# EAGLE design diversity (EAGLE 7.2.0)
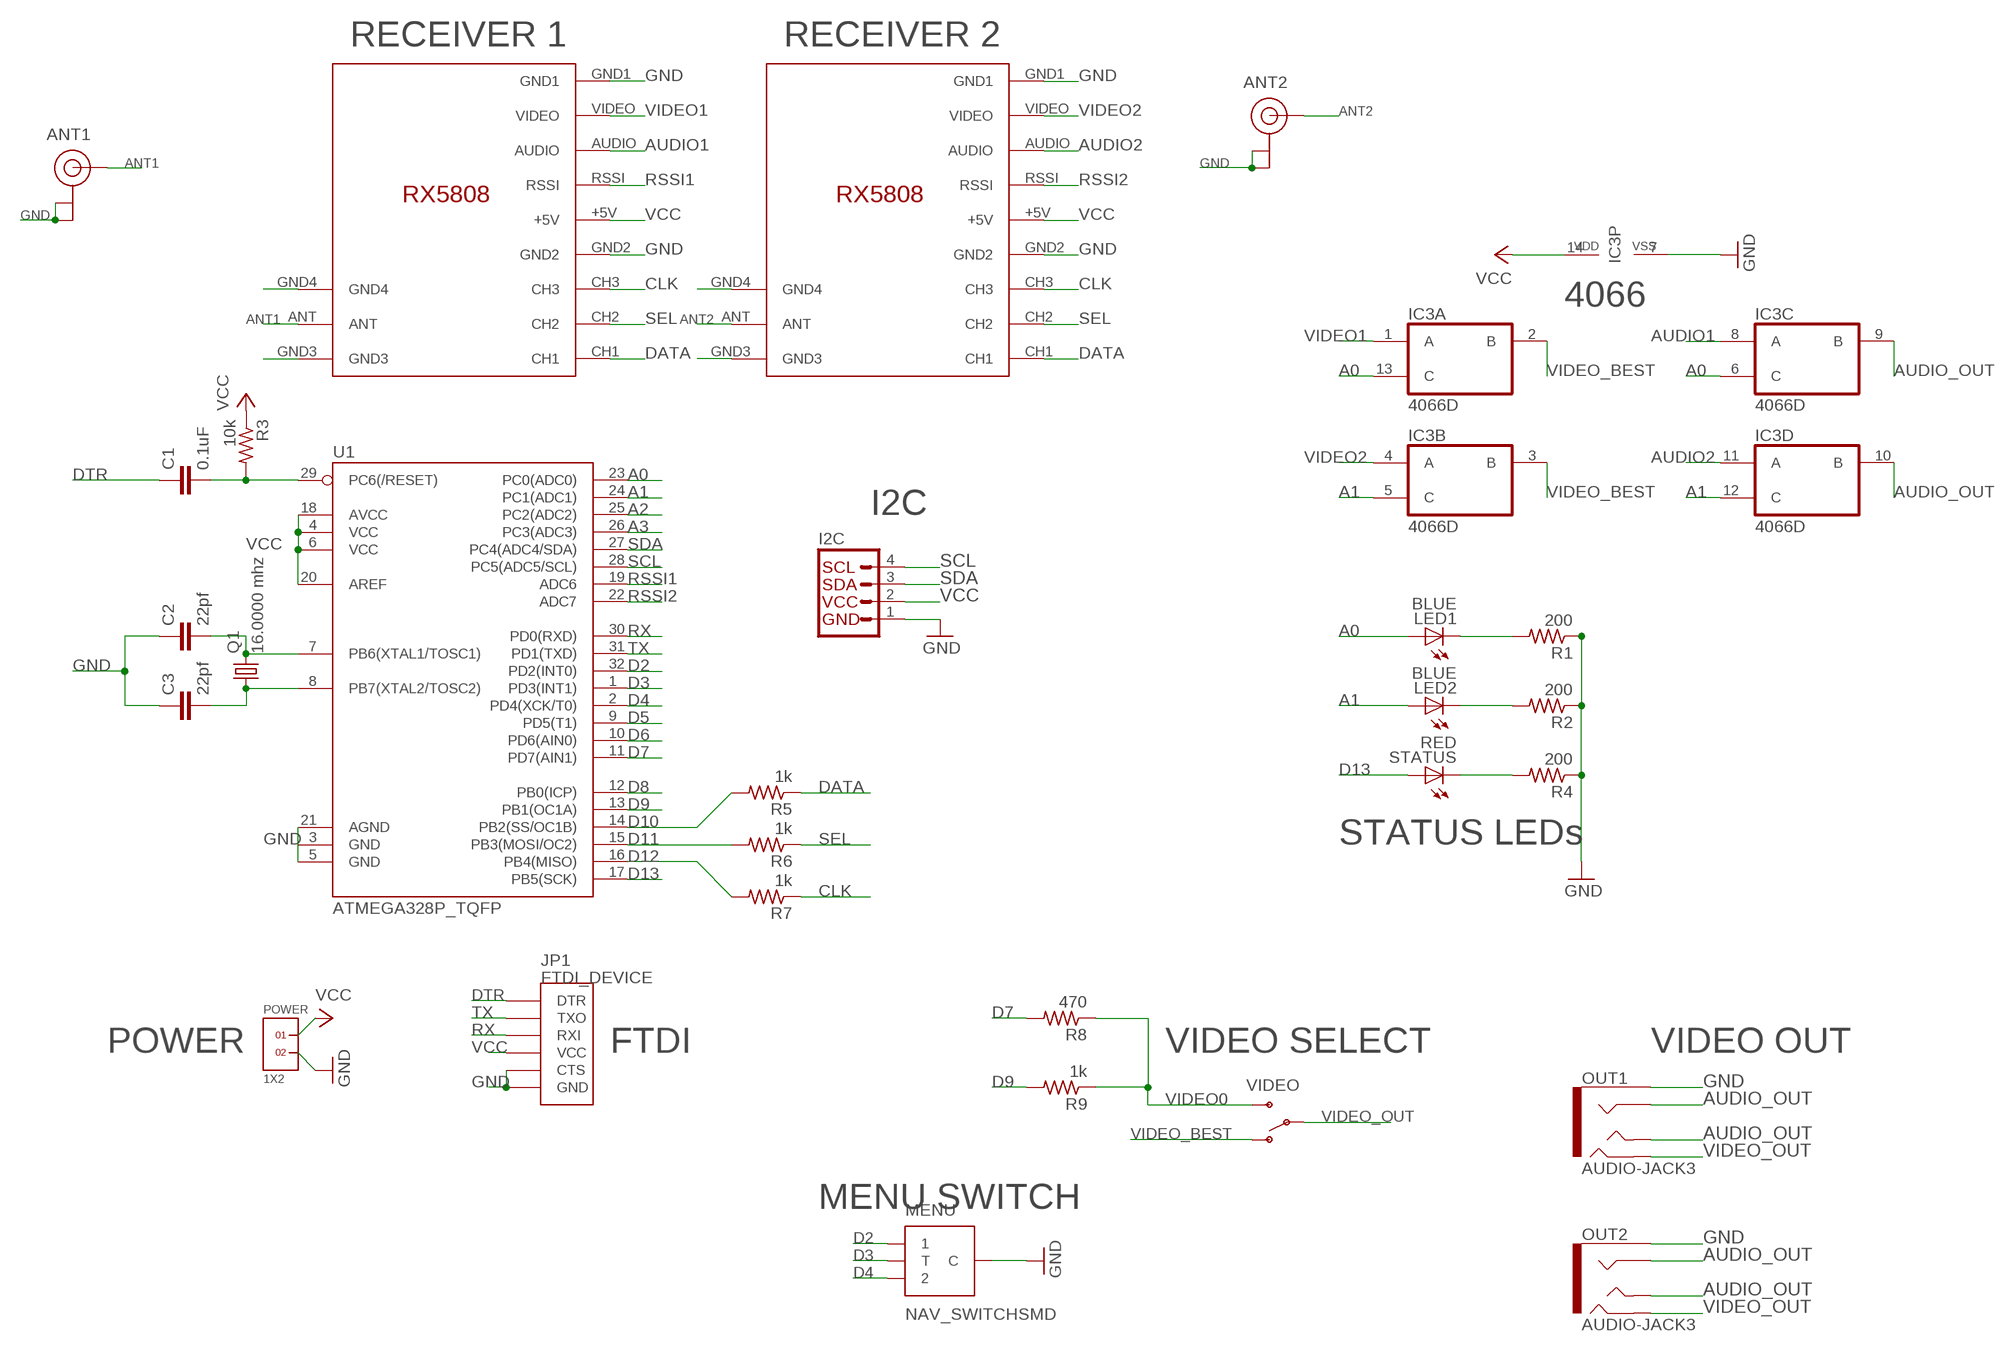
[diagram p0: schematic, sheet 1]

## Parts
ANT1  U.FL  [U.FL]
ANT2  U.FL  [U.FL]
C1  0.1uF  0.1UF-25V(+80/-20%)(0603)  [0603-CAP]
C2  22pf  0.1UF-25V(+80/-20%)(0603)  [0603-CAP]
C3  22pf  0.1UF-25V(+80/-20%)(0603)  [0603-CAP]
I2C  I2C_STANDARD  [1X04]
IC3  4066D  [SO14]
JP1  FTDI_DEVICE  [FTDI_DEVICE_SIDE]
LED1  BLUE  LEDSML0603  [SML0603]
LED2  BLUE  LEDSML0603  [SML0603]
MENU  NAV_SWITCHSMD  [NAV_SWITCH]
OUT1  AUDIO-JACK3  [AUDIO-JACK-TRRS-SMD]
OUT2  AUDIO-JACK3  [AUDIO-JACK-TRRS-SMD]
POWER  1X2  [1X2]
Q1  16.0000 mhz  CRYSTALHC49U-V  [HC49U-V]
R1  200  R-US_R0603  [R0603]
R2  200  R-US_R0603  [R0603]
R3  10k  R-US_R0603  [R0603]
R4  200  R-US_R0603  [R0603]
R5  1k  R-US_R0603  [R0603]
R6  1k  R-US_R0603  [R0603]
R7  1k  R-US_R0603  [R0603]
R8  470  R-US_R0603  [R0603]
R9  1k  R-US_R0603  [R0603]
RECEIVER_A  RX5808_A  RX5808  [RX5808]
RECEIVER_B  RX5808_B  RX5808  [RX5808]
STATUS  RED  LEDSML0603  [SML0603]
U1  ATMEGA328P_TQFP  [TQFP32-08]
VIDEO  SWITCH-SPDTSMD2  [SWITCH-SPDT-SMD]

## Nets
A0: IC3.6(C:C) IC3.13(A:C) LED1.A U1.23(PC0(ADC0))
A1: IC3.5(B:C) IC3.12(D:C) LED2.A U1.24(PC1(ADC1))
A2: U1.25(PC2(ADC2))
A3: U1.26(PC3(ADC3))
ANT1: ANT1.P$3(SIGNAL) RECEIVER_A.ANT
ANT2: ANT2.P$3(SIGNAL) RECEIVER_B.ANT
AUDIO1: IC3.8(C:A) RECEIVER_A.AUDIO
AUDIO2: IC3.11(D:A) RECEIVER_B.AUDIO
AUDIO_OUT: IC3.9(C:B) IC3.10(D:B) OUT1.RING1 OUT1.TIP OUT2.RING1 OUT2.TIP
CLK: R7.1 RECEIVER_A.CH3 RECEIVER_B.CH3
D2: MENU.1 U1.32(PD2(INT0))
D3: MENU.T U1.1(PD3(INT1))
D4: MENU.2 U1.2(PD4(XCK/T0))
D5: U1.9(PD5(T1))
D6: U1.10(PD6(AIN0))
D7: R8.2 U1.11(PD7(AIN1))
D8: U1.12(PB0(ICP))
D9: R9.2 U1.13(PB1(OC1A))
D10: R5.2 U1.14(PB2(SS/OC1B))
D11: R6.2 U1.15(PB3(MOSI/OC2))
D12: R7.2 U1.16(PB4(MISO))
D13: STATUS.A U1.17(PB5(SCK))
DATA: R5.1 RECEIVER_A.CH1 RECEIVER_B.CH1
DTR: C1.1 JP1.P$1(DTR)
GND: ANT1.P$1(GND) ANT1.P$2(GND) ANT2.P$1(GND) ANT2.P$2(GND) C2.1 C3.1 I2C.1 IC3.7(P:VSS) JP1.P$5(CTS) JP1.P$6(GND) MENU.C OUT1.EARTH OUT2.EARTH POWER.2 R1.1 R2.1 R4.1 RECEIVER_A.GND1 RECEIVER_A.GND2 RECEIVER_A.GND3 RECEIVER_A.GND4 RECEIVER_B.GND1 RECEIVER_B.GND2 RECEIVER_B.GND3 RECEIVER_B.GND4 U1.5(GND) U1.21(AGND)
N$1: LED1.C R1.2
N$2: LED2.C R2.2
N$5: C2.2 Q1.2 U1.7(PB6(XTAL1/TOSC1))
N$6: C1.2 R3.2 U1.29(PC6(/RESET))
N$7: C3.2 Q1.1 U1.8(PB7(XTAL2/TOSC2))
N$28: R4.2 STATUS.C
RSSI1: RECEIVER_A.RSSI U1.19(ADC6)
RSSI2: RECEIVER_B.RSSI U1.22(ADC7)
RX: JP1.P$3(RXI) U1.30(PD0(RXD))
SCL: I2C.4 U1.28(PC5(ADC5/SCL))
SDA: I2C.3 U1.27(PC4(ADC4/SDA))
SEL: R6.1 RECEIVER_A.CH2 RECEIVER_B.CH2
TX: JP1.P$2(TXO) U1.31(PD1(TXD))
VCC: I2C.2 IC3.14(P:VDD) JP1.P$4(VCC) POWER.1 R3.1 RECEIVER_A.+5V RECEIVER_B.+5V U1.4(VCC) U1.6(VCC) U1.18(AVCC) U1.20(AREF)
VIDEO0: R8.1 R9.1 VIDEO.3(S)
VIDEO1: IC3.1(A:A) RECEIVER_A.VIDEO
VIDEO2: IC3.4(B:A) RECEIVER_B.VIDEO
VIDEO_BEST: IC3.2(A:B) IC3.3(B:B) VIDEO.1(O)
VIDEO_OUT: OUT1.RING2 OUT2.RING2 VIDEO.2(P)
Unconnected: U1.3(GND)

## Notes on the sheet
- RECEIVER 1 | RECEIVER 2
- 4066
- I2C
- STATUS LEDs
- POWER | FTDI | VIDEO SELECT | VIDEO OUT
- MENU SWITCH

## Library data of the parts
ANT1 ANT2 = SparkFun-Connectors:U.FL: SMD antenna connector- WRL-09144; PROD_ID: CONN-09193
C1 = SparkFun-Capacitors:0.1UF-25V(+80/-20%)(0603): CAP-00810 Ceramic Standard decoupling cap; PROD_ID: CAP-00810
C2 C3 = SparkFun-Capacitors:0.1UF-25V(+80/-20%)(0603): CAP-00810 Ceramic Standard decoupling cap; PROD_ID: CAP-00810; VALUE: 0.1uF
I2C = SparkFun-Connectors:I2C_STANDARD: SparkFun has standardized on a pinout for all I2C based sensor breakouts. This pinout allows I2C boards to be plugged directly into the headers on Arduino Uno compatible boards, and to be daisy chained easily.
IC3 = 40xx:4066: Quad bilateral ANALOG SWITCH
JP1 = SparkFun-Connectors:FTDI_DEVICE: Connector which mates to FTDI basic or FTDI cable.
LED1 LED2 STATUS = led:LED: LED OSRAM: - CHIPLED LG R971, LG N971, LY N971, LG Q971, LY Q971, LO R971, LY R971 LH N974, LH R974 LS Q976, LO Q976, LY Q976 LO Q996 - Hyper CHIPLED LW Q18S LB Q993, LB Q99A, LB R99A - SideLED LS A670, LO A670, LY A670, LG A670, LP A670 LB A673, LV A673, LT A673, LW A673 LH A674 LY A675 LS A676, LA A676, LO A676, LY A676, LW A676 LS A679, LY A679, LG A679 - Hyper Micro SIDELED® LS Y876, LA Y876, LO Y876, LY Y876 LT Y87S - SmartLED LW L88C, LW L88S LB L89C, LB L89S, LG L890 LS L89K, LO L89K, LY L89K LS L896, LA L896, LO L896, LY L896 - TOPLED LS T670, LO T670, LY T670, LG T670, LP T670 LSG T670, LSP T670, LSY T670, LOP T670, LYG T670 LG T671, LOG T671, LSG T671 LB T673, LV T673, LT T673, LW T673 LH T674 LS T676, LA T676, LO T676, LY T676, LB T676, LH T676, LSB T676, LW T676 LB T67C, LV T67C, LT T67C, LS T67K, LO T67K, LY T67K, LW E67C LS E67B, LA E67B, LO E67B, LY E67B, LB E67C, LV E67C, LT E67C LW T67C LS T679, LY T679, LG T679 LS T770, LO T770, LY T770, LG T770, LP T770 LB T773, LV T773, LT T773, LW T773 LH T774 LS E675, LA E675, LY E675, LS T675 LS T776, LA T776, LO T776, LY T776, LB T776 LHGB T686 LT T68C, LB T68C - Hyper Mini TOPLED® LB M676 - Mini TOPLED Santana® LG M470 LS M47K, LO M47K, LY M47K Source: http://www.osram.convergy.de LUXEON: - LUMILED® LXK2-PW12-R00, LXK2-PW12-S00, LXK2-PW14-U00, LXK2-PW14-V00 LXK2-PM12-R00, LXK2-PM12-S00, LXK2-PM14-U00 LXK2-PE12-Q00, LXK2-PE12-R00, LXK2-PE12-S00, LXK2-PE14-T00, LXK2-PE14-U00 LXK2-PB12-K00, LXK2-PB12-L00, LXK2-PB12-M00, LXK2-PB14-N00, LXK2-PB14-P00, LXK2-PB14-Q00 LXK2-PR12-L00, LXK2-PR12-M00, LXK2-PR14-Q00, LXK2-PR14-R00 LXK2-PD12-Q00, LXK2-PD12-R00, LXK2-PD12-S00 LXK2-PH12-R00, LXK2-PH12-S00 LXK2-PL12-P00, LXK2-PL12-Q00, LXK2-PL12-R00 Source: www.luxeon.com KINGBRIGHT: KA-3528ASYC Source: www.kingbright.com
MENU = SparkFun-Electromechanical:NAV_SWITCH: Navigation Switch Three way navigation switch. Commonly used as up/down/select on MP3 players. Schematic element and footprint production proven. Spark Fun Electronics SKU : COM-08184; PROD_ID: SWCH-08301
OUT1 OUT2 = SparkFun-Connectors:AUDIO-JACK3: Audio jack - 3.5mm TRRS variety - two rings.
POWER = headers(.1in):1X2
Q1 = crystal:CRYSTAL: CRYSTAL; OC_FARNELL: 1666969; OC_NEWARK: unknown
R1-R9 = resistor:R-US_: RESISTOR, American symbol
RECEIVER_A RECEIVER_B = 1customstuff:RX5808
U1 = SparkFun-DigitalIC:ATMEGA328P_TQFP; PROD_ID: IC-09069
VIDEO = SparkFun-Electromechanical:SWITCH-SPDT: SPDT Switch Simple slide switch, Spark Fun Electronics SKU : COM-00102 DPDT SMT slide switch, AYZ0202, SWCH-08179

## Board
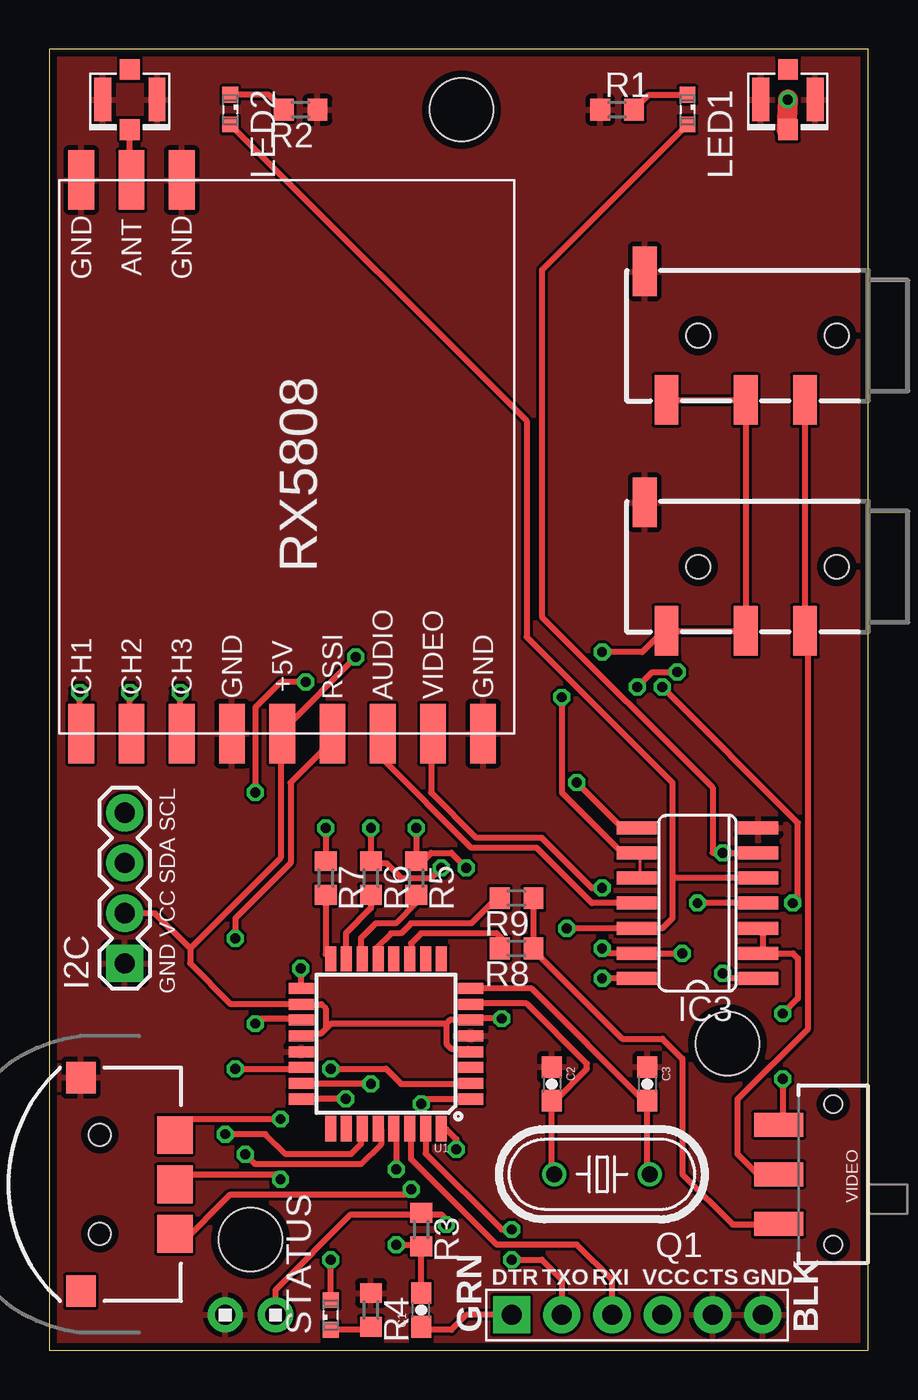
[diagram p1: board, top side]
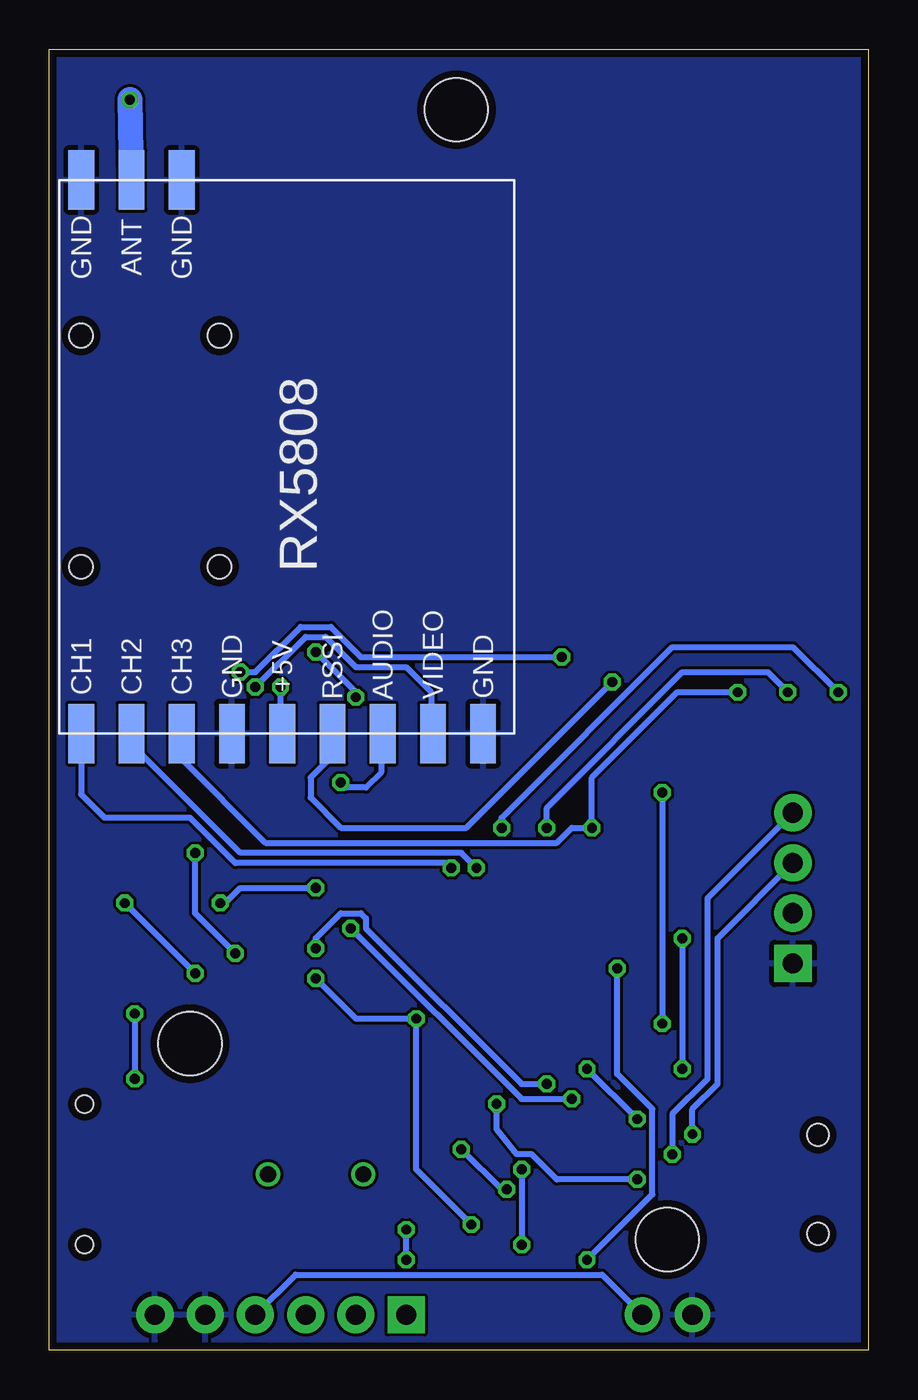
[diagram p2: board, bottom side, seen from below]

Size 41.4 x 65.79 mm. Coordinates in mm from the lower left corner, seen from the top.
Outline: 0,0 41.4,0 41.4,65.79 0,65.79 0,0
Copper layers (1*16): Top 0.0356mm / dielectric 1.5011mm / Bottom 0.0356mm
Design rules "LaenPCBOrder": minimum track width 6mil, minimum drill 13mil, track to track 6mil, track to pad 6mil, pad to pad 6mil, via to via 6mil, smd to smd 6mil, copper to edge 15mil, drill to drill 6mil, minimum pad ring 7mil, minimum via ring 7mil, stop-mask expansion 3mil, vias tented up to drill 0mil, thermal gap 10mil
Holes 3.2 mm at 20.83,62.74 34.29,15.49 10.16,5.59

### Footprints (pad centres in the part's own frame; a part is rotated, then mirrored left to right if it is on the bottom)
U.FL = smd 2.2 x 0.85: P$1 0,1.375; P$2 0,-1.375 | smd 1.05 x 1: P$3 1.525,0; P$4 -1.525,0
0603-CAP = smd 1.1 x 1: 1 -0.85,0; 2 0.85,0
1X04 = drill 1.016 pad 1.88 square: 1 0,0 | drill 1.016 pad 1.88: 2 2.54,0; 3 5.08,0; 4 7.62,0
SO14 = smd 0.66 x 2.032: 1 -3.81,-3.073; 2 -2.54,-3.073; 3 -1.27,-3.073; 4 0,-3.073; 5 1.27,-3.073; 6 2.54,-3.073; 7 3.81,-3.073; 8 3.81,3.073; 9 2.54,3.073; 10 1.27,3.073; 11 0,3.073; 12 -1.27,3.073; 13 -2.54,3.073; 14 -3.81,3.073
FTDI_DEVICE_SIDE = drill 1.016 pad 1.88 square: P$1 -6.35,0 | drill 1.016 pad 1.88: P$2 -3.81,0; P$3 -1.27,0; P$4 1.27,0; P$5 3.81,0; P$6 6.35,0
SML0603 = smd 0.8 x 0.8: A 0.75,0; C -0.75,0
NAV_SWITCH = smd 1.9 x 1.8: 1 -2.5,-3.8; 2 2.5,-3.8; T 0,-3.8 | smd 1.6 x 1.5: C 5.4,0.95; NC -5.4,0.95 | hole 1.1: -2.5,0; 2.5,0
AUDIO-JACK-TRRS-SMD = smd 1.2 x 2.5: EARTH 11.3,-3.25; RING1 6.2,3.25; RING2 3.2,3.25; TIP 10.2,3.25 | hole 1.2: 1.6,0; 8.6,0
1X2 = drill 1.016 pad 1.778: 1 0,0; 2 2.54,0
HC49U-V = drill 0.813: 1 -2.413,0; 2 2.413,0
R0603 = smd 1 x 1.1: 1 -0.85,0; 2 0.85,0
RX5808 = smd 3 x 1.3: +5V 28,11.26; ANT 0,3.64; AUDIO 28,16.34; CH1 28,1.1; CH2 28,3.64; CH3 28,6.18; GND1 28,21.42; GND2 28,8.72; GND3 0,1.1; GND4 0,6.18; RSSI 28,13.8; VIDEO 28,18.88
TQFP32-08 = smd 1.27 x 0.559: 1 -4.293,2.8; 2 -4.293,2; 3 -4.293,1.2; 4 -4.293,0.4; 5 -4.293,-0.4; 6 -4.293,-1.2; 7 -4.293,-2; 8 -4.293,-2.8; 17 4.293,-2.8; 18 4.293,-2; 19 4.293,-1.2; 20 4.293,-0.4; 21 4.293,0.4; 22 4.293,1.2; 23 4.293,2; 24 4.293,2.8 | smd 0.559 x 1.27: 9 -2.8,-4.293; 10 -2,-4.293; 11 -1.2,-4.293; 12 -0.4,-4.293; 13 0.4,-4.293; 14 1.2,-4.293; 15 2,-4.293; 16 2.8,-4.293; 25 2.8,4.293; 26 2,4.293; 27 1.2,4.293; 28 0.4,4.293; 29 -0.4,4.293; 30 -1.2,4.293; 31 -2,4.293; 32 -2.8,4.293
SWITCH-SPDT-SMD = smd 1.2 x 2.5: 1 -2.5,-2.75; 2 0,-2.75; 3 2.5,-2.75 | hole 0.9: -3.55,0; 3.55,0

### Placement (x,y rotation side)
ANT1  37.34,63.25 270 top
ANT2  4.06,63.25 270 top
C1  18.8,2.03 90 top
C2  25.4,13.46 270 top
C3  30.23,13.46 270 top
I2C  3.81,19.56 90 top
IC3  32.77,22.61 90 top
JP1  29.72,1.78 0 top
LED1  32.26,62.74 270 top
LED2  9.14,62.74 270 top
MENU  2.54,8.38 90 top
OUT1  41.4,51.31 180 top
OUT2  41.4,39.62 180 top
POWER  11.43,1.78 180 top
Q1  27.94,8.89 180 top
R1  28.7,62.74 0 top
R2  12.7,62.74 180 top
R3  18.8,6.1 270 top
R4  16.26,2.03 270 top
R5  18.54,23.88 270 top
R6  16.26,23.88 270 top
R7  13.97,23.88 270 top
R8  23.62,20.32 180 top
R9  23.62,22.86 180 top
RECEIVER_A  40.89,59.18 270 bottom
RECEIVER_B  0.51,59.18 270 top
STATUS  14.22,1.78 90 top
U1  17.02,15.49 180 top
VIDEO  39.62,8.89 270 top

### Tracks (layer width: path | path; a pad name or v marks a point on that pad's centre or on a via)
A0  (via drill 0.5 pad 0.25)
  Top 0.305: LED1.A 24.89,54.62 24.89,37.08 33.53,28.45 33.53,25.15 v34.04,25.15 IC3.6 | v32,20.07 IC3.13 28.19,20.07 v27.94,20.32 | v16.26,13.46 12.95,13.46 U1.23
  Bottom 0.305: v34.04,25.15 34.04,22.1 v32,20.07 | v16.26,13.46 17.53,13.46 25.4,21.34 25.4,21.84 25.65,22.1 26.67,22.1 27.94,20.83 v27.94,20.32
A1  (via drill 0.5 pad 0.25)
  Top 0.305: LED2.A 24.13,47 24.13,36.07 31.5,28.7 31.5,23.88 | 31.5,23.88 31.5,21.84 30.99,21.34 IC3.12 v26.16,21.34 | IC3.5 31.5,23.88 | v14.99,12.7 12.95,12.7 U1.24
  Bottom 0.305: v14.99,12.7 17.53,12.7 v26.16,21.34
ANT1  (via drill 0.5 pad 0.25)
  Top 0.305: ANT1.P$3 37.25,61.38 37.25,61.72
  Top 1.016: v37.34,63.25 37.25,61.72
  Bottom 1.27: v37.34,63.25 RECEIVER_A.ANT
ANT2
  Top 0.305: RECEIVER_B.ANT 4.06,59.27 ANT2.P$3
AUDIO1  (via drill 0.5 pad 0.25)
  Top 0.305: IC3.8 28.96,26.42 v26.67,28.7
  Bottom 0.305: v26.67,28.7 26.42,28.45 25.4,28.45 24.64,29.21 24.64,30.99 RECEIVER_A.AUDIO
AUDIO2
  Top 0.305: IC3.11 27.43,22.61 24.64,25.4 21.34,25.4 16.76,29.97 16.76,30.99 RECEIVER_B.AUDIO
AUDIO_OUT  (via drill 0.5 pad 0.25)
  Top 0.152: IC3.10 29.84,24.13 29.84,25.08 IC3.9
  Top 0.305: OUT1.TIP OUT1.RING1 OUT2.RING1 OUT2.TIP 30.99,36.32 29.97,35.31 v27.94,35.31 | IC3.9 28.96,25.15 25.91,28.19 v25.91,33.02
  Bottom 0.305: v25.91,33.02 25.91,33.27 v27.94,35.31
CLK  (via drill 0.5 pad 0.25)
  Top 0.305: v6.6,33.27 6.6,31.24 RECEIVER_B.CH3 | v13.97,26.42 R7.1
  Bottom 0.305: v6.6,33.27 9.65,33.27 13.97,28.96 v13.97,26.42 14.99,26.42 15.75,25.65 30.48,25.65 34.8,29.97 34.8,30.99 RECEIVER_A.CH3
D2  (via drill 0.5 pad 0.25)
  Top 0.305: v20.57,10.16 20.57,10.67 20.07,11.18 U1.32 | v18.29,8.13 18.03,7.87 9.14,7.87 6.6,5.33 6.1,5.84 MENU.1
  Bottom 0.305: v20.57,10.16 18.54,8.13 v18.29,8.13
D3  (via drill 0.5 pad 0.25)
  Top 0.305: v18.8,12.45 19.05,12.7 21.08,12.7 U1.1 | v11.68,8.64 11.43,8.89 6.6,8.89 6.1,8.38 MENU.T
  Bottom 0.305: v11.68,8.64 15.75,8.64 17.02,9.91 17.78,9.91 18.8,11.18 v18.8,12.45
D4  (via drill 0.5 pad 0.25)
  Top 0.305: v14.22,14.22 17.02,14.22 17.78,13.46 21.08,13.46 U1.2 | v11.68,11.68 6.6,11.68 6.35,11.43 6.35,10.92 MENU.2
  Bottom 0.305: v11.68,11.68 v14.22,14.22
D7
  Top 0.305: U1.11 18.29,19.81 18.29,20.57 18.8,21.08 22.61,21.08 22.86,20.83 22.86,20.32 R8.2
D9
  Top 0.305: U1.13 16.51,19.81 16.51,20.32 17.27,21.08 17.78,21.08 18.29,21.59 21.34,21.59 22.61,22.86 R9.2
D10
  Top 0.305: R5.2 18.54,22.61 17.53,21.59 16.51,21.59 15.75,20.83 15.75,19.86 U1.14
D11
  Top 0.305: R6.2 16.26,22.35 14.99,21.08 14.99,19.82 U1.15
D12
  Top 0.305: R7.2 13.97,20.04 U1.16
D13  (via drill 0.5 pad 0.25)
  Top 0.305: v12.7,19.3 12.7,18.54 U1.17 | STATUS.A v14.22,4.57
  Bottom 0.305: v12.7,19.3 12.7,13.97 10.92,12.19 10.92,7.87 v14.22,4.57
DATA  (via drill 0.5 pad 0.25)
  Top 0.305: v1.52,33.27 1.52,31.24 RECEIVER_B.CH1 | v18.54,26.42 R5.1 18.54,24.64 18.8,24.64 19.3,25.15 20.32,25.15 v21.08,24.38
  Bottom 0.305: v18.54,26.42 18.54,26.92 9.91,35.56 3.81,35.56 v1.52,33.27 | RECEIVER_A.CH1 39.79,28.11 38.61,26.92 34.29,26.92 32,24.64 21.34,24.64 v21.08,24.38
DTR
  Top 0.305: JP1.P$1 21.08,1.78 20.32,1.02 18.96,1.02 C1.1
GND
  pour Top: 0,0 41.66,0 41.66,65.79 0,65.79
  pour Bottom: 0,0 41.66,0 41.66,65.79 0,65.79
N$1
  Top 0.305: R1.2 30.3,63.49 LED1.C
N$2
  Top 0.305: R2.2 11.1,63.49 LED2.C
N$5
  Top 0.305: Q1.2 25.4,8.89 C2.2 25.57,12.61 27.18,14.22 27.18,14.48 24.13,17.53 21.34,17.53 U1.7
N$6  (via drill 0.5 pad 0.25)
  Top 0.305: C1.2 R3.2 18.8,5.33 v17.53,5.33 | v17.53,9.14 17.53,11.18 U1.29
  Bottom 0.305: v17.53,9.14 v17.53,5.33
N$7
  Top 0.305: Q1.1 30.23,8.89 C3.2 30.06,12.61 24.38,18.29 U1.8
N$28
  Top 0.305: R4.2 16.1,1.03 STATUS.C
RSSI1  (via drill 0.5 pad 0.25)
  Top 0.305: v10.41,28.19 10.41,32.51 11.68,33.78 v12.95,33.78 | U1.19 12.7,16.76 10.41,16.76 v10.41,16.51
  Bottom 0.305: RECEIVER_A.RSSI 27.09,30.06 28.19,28.96 28.19,27.94 26.67,26.42 20.32,26.42 v12.95,33.78 | v10.41,28.19 v10.41,16.51
RSSI2  (via drill 0.5 pad 0.25)
  Top 0.305: RECEIVER_B.RSSI 14.31,30.82 12.19,28.7 12.19,24.64 9.4,21.84 v9.4,20.83 | v9.4,14.22 12.7,14.22 U1.22
  Bottom 0.305: v9.4,20.83 v9.4,14.22
RX
  Top 0.305: JP1.P$3 28.45,3.56 26.67,5.33 22.61,5.33 18.29,9.65 18.29,11.13 U1.30
SCL  (via drill 0.5 pad 0.25)
  Top 0.305: v9.91,9.91 10.41,9.4 15.75,9.4 16.76,10.41 16.76,11.18 U1.28
  Bottom 0.305: v9.91,9.91 9.91,11.94 8.13,13.72 8.13,22.86 I2C.4
SDA  (via drill 0.5 pad 0.25)
  Top 0.305: v8.89,10.92 10.92,10.92 11.94,9.91 15.24,9.91 15.75,10.41 15.75,11.18 U1.27
  Bottom 0.305: v8.89,10.92 8.89,12.19 7.62,13.46 7.62,20.83 I2C.3
SEL  (via drill 0.5 pad 0.25)
  Top 0.305: v4.06,33.27 4.06,31.24 RECEIVER_B.CH2 | v16.26,26.42 R6.1 16.26,24.64 17.02,24.64 17.78,23.88 19.3,23.88 v19.81,24.38
  Bottom 0.305: v16.26,26.42 16.26,27.43 9.4,34.29 5.08,34.29 v4.06,33.27 | v19.81,24.38 20.57,25.15 31.75,25.15 37.34,30.73 37.34,30.99 RECEIVER_A.CH2
TX  (via drill 0.5 pad 0.25)
  Top 0.305: U1.31 19.02,9.94 22.86,6.1 v23.37,6.1 | v23.37,4.57 24.89,4.57 25.91,3.56 JP1.P$2
  Bottom 0.305: v23.37,4.57 v23.37,6.1
VCC  (via drill 0.5 pad 0.25)
  Top 0.305: POWER.1 11.43,3.05 15.24,6.86 18.71,6.86 R3.1 18.8,6.86 19.81,6.86 20.07,6.6 v20.07,6.35 | IC3.14 v27.94,18.8 | 20.07,16.51 20.25,16.69 U1.6 21.34,16.76 v22.86,16.76 | 20.07,16.51 20.07,15.49 20.32,15.24 21.16,15.24 U1.4 | 13.97,16.26 13.97,17.27 13.75,17.49 U1.18 9.18,17.49 7.11,19.56 7.11,20.32 | 13.97,16.26 13.72,16 12.83,16 U1.20 | 7.11,20.32 11.68,24.89 11.68,30.99 RECEIVER_B.+5V 11.94,31.5 v15.49,35.05 | 20.07,16.51 14.22,16.51 13.97,16.26 | v31.75,34.29 30.48,34.29 v29.72,33.53 | 7.11,20.32 5.33,22.1 I2C.2
  Bottom 0.305: JP1.P$4 28.96,3.81 13.46,3.81 POWER.1 | v27.94,18.8 25.91,16.76 v22.86,16.76 22.86,9.14 v20.07,6.35 | v15.49,35.05 25.65,35.05 27.18,36.58 28.7,36.58 30.99,34.29 v31.75,34.29 | v29.72,33.53 29.72,31.24 RECEIVER_A.+5V
VIDEO0
  Top 0.305: R9.1 R8.1 24.64,20.32 24.64,20.07 28.96,15.75 30.99,15.75 32,14.73 32,8.89 34.54,6.35 36.83,6.35 VIDEO.3 36.83,6.6
VIDEO1  (via drill 0.5 pad 0.25)
  Top 0.305: v30.99,33.53 37.85,26.67 37.85,22.86 v37.59,22.61 | v34.04,19.05 34.29,18.8 IC3.1
  Bottom 0.305: v30.99,33.53 28.45,36.07 27.43,36.07 25.91,34.54 23.37,34.54 22.1,33.27 22.1,31.27 RECEIVER_A.VIDEO | v34.04,19.05 v37.59,22.61
VIDEO2  (via drill 0.5 pad 0.25)
  Top 0.305: 19.3,30.73 19.3,30.99 RECEIVER_B.VIDEO 19.3,30.73 | IC3.4 v32.77,22.61 | 19.3,30.73 19.3,28.19 21.59,25.91 24.89,25.91 27.43,23.37 v27.94,23.37
  Bottom 0.305: v27.94,23.37 31.75,23.37 32.51,22.61 v32.77,22.61
VIDEO_BEST  (via drill 0.5 pad 0.25)
  Top 0.305: 36.07,20.07 36.07,21.34 IC3.3 | v37.08,13.72 37.08,11.43 VIDEO.1 | v37.08,17.02 37.85,17.78 37.85,19.81 37.59,20.07 36.07,20.07 | 36.07,20.07 IC3.2
  Bottom 0.305: v37.08,17.02 v37.08,13.72
VIDEO_OUT
  Top 0.305: OUT1.RING2 OUT2.RING2 38.35,36.22 38.35,16.26 34.8,12.7 34.8,9.91 35.81,8.89 VIDEO.2

### Text on the board
tPlace: GND VCC SDA SCL